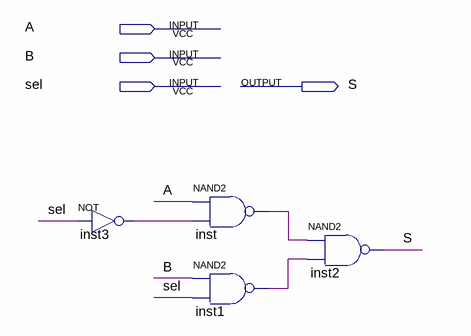
[diagram p0: schematic sheet]
// Quartus schematic mux2_1b.bdf as structural Verilog: 4 symbols, 4 pins
module mux2_1b (
  input  A,
  input  B,
  input  sel,
  output S
);

  wire inst1_out, inst3_out, inst_out;

  not inst3 (inst3_out, sel);
  nand inst (inst_out, A, inst3_out);
  nand inst1 (inst1_out, B, sel);
  nand inst2 (S, inst_out, inst1_out);
endmodule
